# Altium schematic sheet JTAG_FPGA_IDC14_2mm.SchDoc
size A3
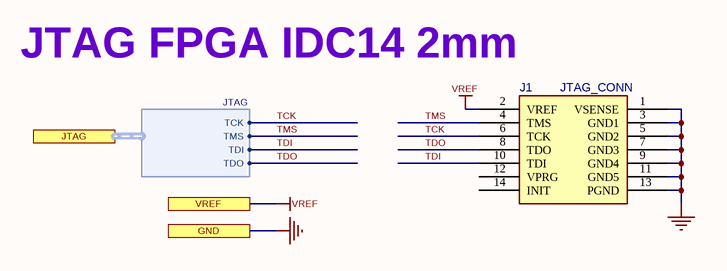
[diagram p0: JTAG_FPGA_IDC14_2mm.SchDoc]

## Parts
J1  JTAG_CONN  [IDC2_2X7]

## Ports
GND, JTAG (harness JTAG), VREF

## Harnesses
JTAG: TCK, TMS, TDI, TDO

## Nets
GND: J1.1(VSENSE) J1.3(GND1) J1.5(GND2) J1.7(GND3) J1.9(GND4) J1.11(GND5) J1.13(PGND) ; port GND
VREF: J1.2(VREF) ; port VREF
TCK: J1.6(TCK) ; port JTAG.TCK
TDI: J1.10(TDI) ; port JTAG.TDI
TDO: J1.8(TDO) ; port JTAG.TDO
TMS: J1.4(TMS) ; port JTAG.TMS

Not connected (* = marked no-connect by the designer): J1 12(VPRG) 14(INIT)

## Notes on the sheet
- JTAG FPGA IDC14 2mm
- Title
- Size:
- Date:
- A3
- Number:
- Time:
- Revision:
- Sheet
- of
- File:

## Library data of the parts
J1 = CONN_JTAG_FPGA_14: CONN, JTAG, FPGA, 14P; MANF: MOLEX; DESC: DESCRIPTION; ASSEMBLY: ASSEMBLY; VALUE: JTAG_CONN